# EAGLE design Blinky (EAGLE 8.6.0)
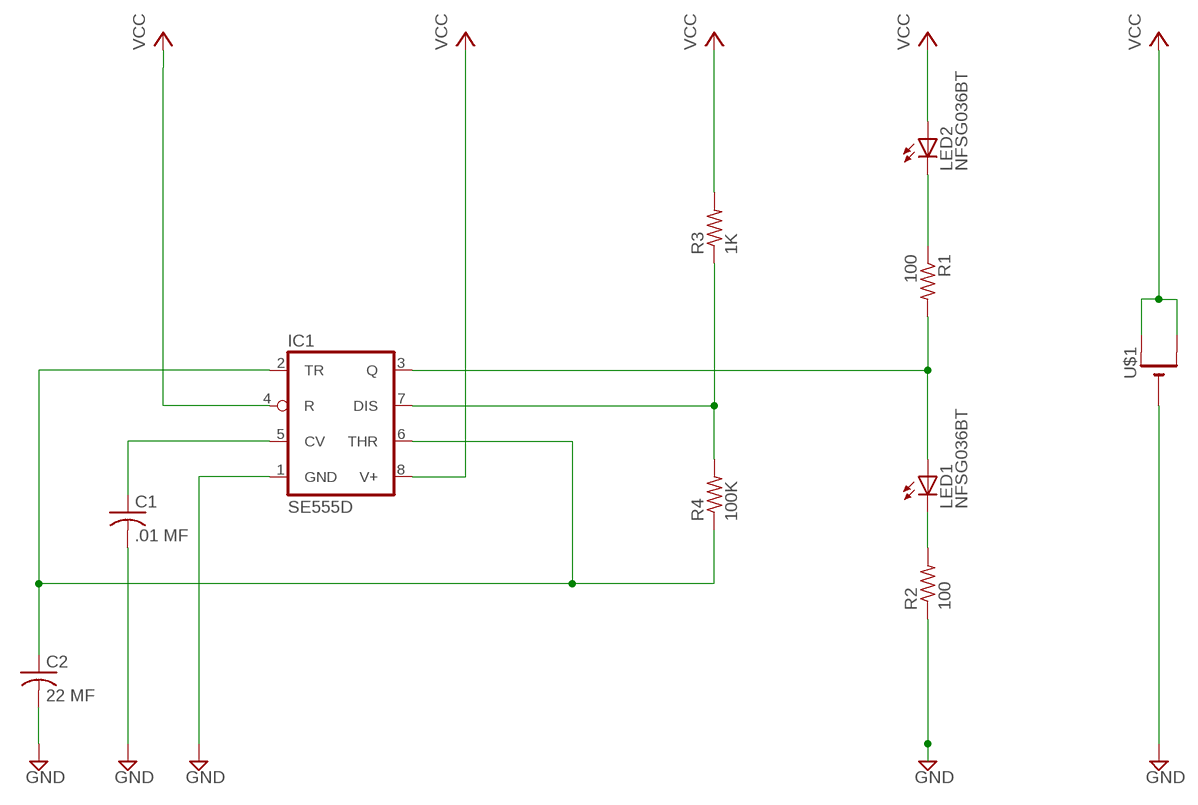
[diagram p0: schematic, sheet 1]

## Parts
C1  .01 MF  C-USC0805  [C0805]
C2  22 MF  C-USC0805  [C0805]
IC1  SE555D  [SO08]
LED1  NFSG036BT  [NFSG036BT]
LED2  NFSG036BT  [NFSG036BT]
R1  100  R-US_M0805  [M0805]
R2  100  R-US_M0805  [M0805]
R3  1K  R-US_M0805  [M0805]
R4  100K  R-US_M0805  [M0805]
U$1  CR1220THM  [CR1220-THM]

## Nets
GND: C1.2 C2.2 IC1.1(GND) R2.1 U$1.-
N$1: C1.1 IC1.5(CV)
N$2: IC1.7(DIS) R3.1 R4.2
N$3: IC1.3(Q) LED1.A R1.2
N$4: LED1.C R2.2
N$5: LED2.C R1.1
N$8: C2.1 IC1.2(TR) IC1.6(THR) R4.1
VCC: IC1.4(R) IC1.8(V+) LED2.A R3.2 U$1.+1(+) U$1.+2(+1)

## Library data of the parts
C1 = adafruit:C-US: CAPACITOR, American symbol; MPN: 885012007009; OC_NEWARK: 15AC9307
C2 = adafruit:C-US: CAPACITOR, American symbol; MPN: GRT21BR60J226ME13L; OC_NEWARK: 01AC8978
IC1 = linear:*555: TIMER; MF: FARNELL; MPN: TLC555CDR; OC_NEWARK: 38K8364
LED1 LED2 = led:NFSG036BT: CHIP TYPE GREEN LED NFSx036xT Source: NICHIA CORPORATION .. NFSG036BT-E.pdf; MPN: KPTD-2012ZGCK; OC_NEWARK: 16AC3387
R1 R2 = resistor:R-US_: RESISTOR, American symbol; MPN: MCTF0805BTC1000; OC_NEWARK: 01P2077
R3 = resistor:R-US_: RESISTOR, American symbol; MF: VISHAY/DALE; MPN: CRCW08051K00FKTA; OC_NEWARK: 05F1507
R4 = resistor:R-US_: RESISTOR, American symbol; MPN: CRCW0805100KFKTA; OC_NEWARK: 11AC2857
U$1 = adafruit:CR1220: CR1216/CR1220/CR1225 12mm 3V lithium coin cell Great for battery packup. Both SMT and THM holders. Note the THM package has the ground pads on both sides of the PCB so that the masks are the same - this reduces the cost; MF: KEYSTONE ELECTR; MPN: 500; OC_NEWARK: 95F3284

## Board
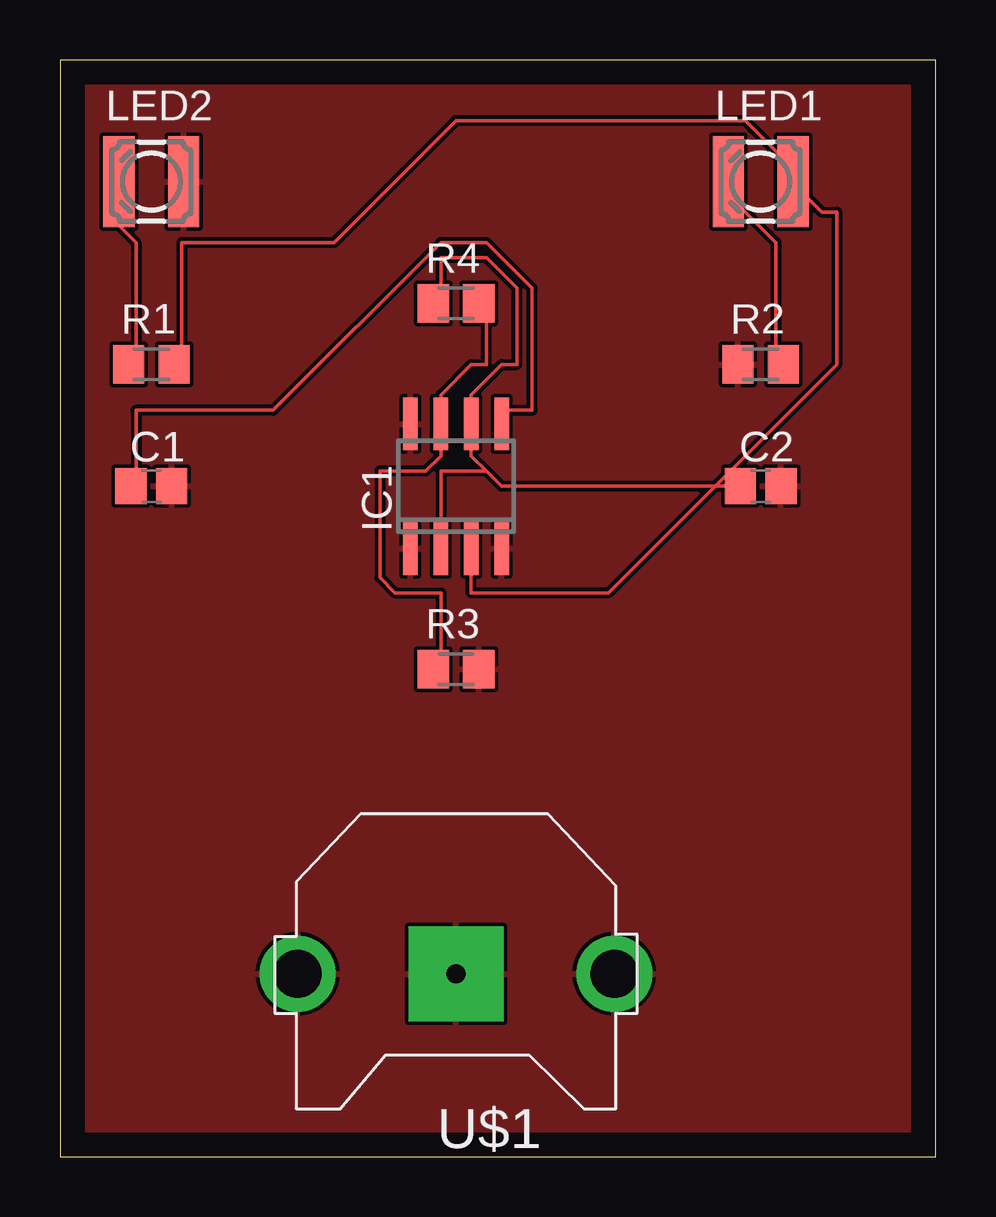
[diagram p1: board, top side]
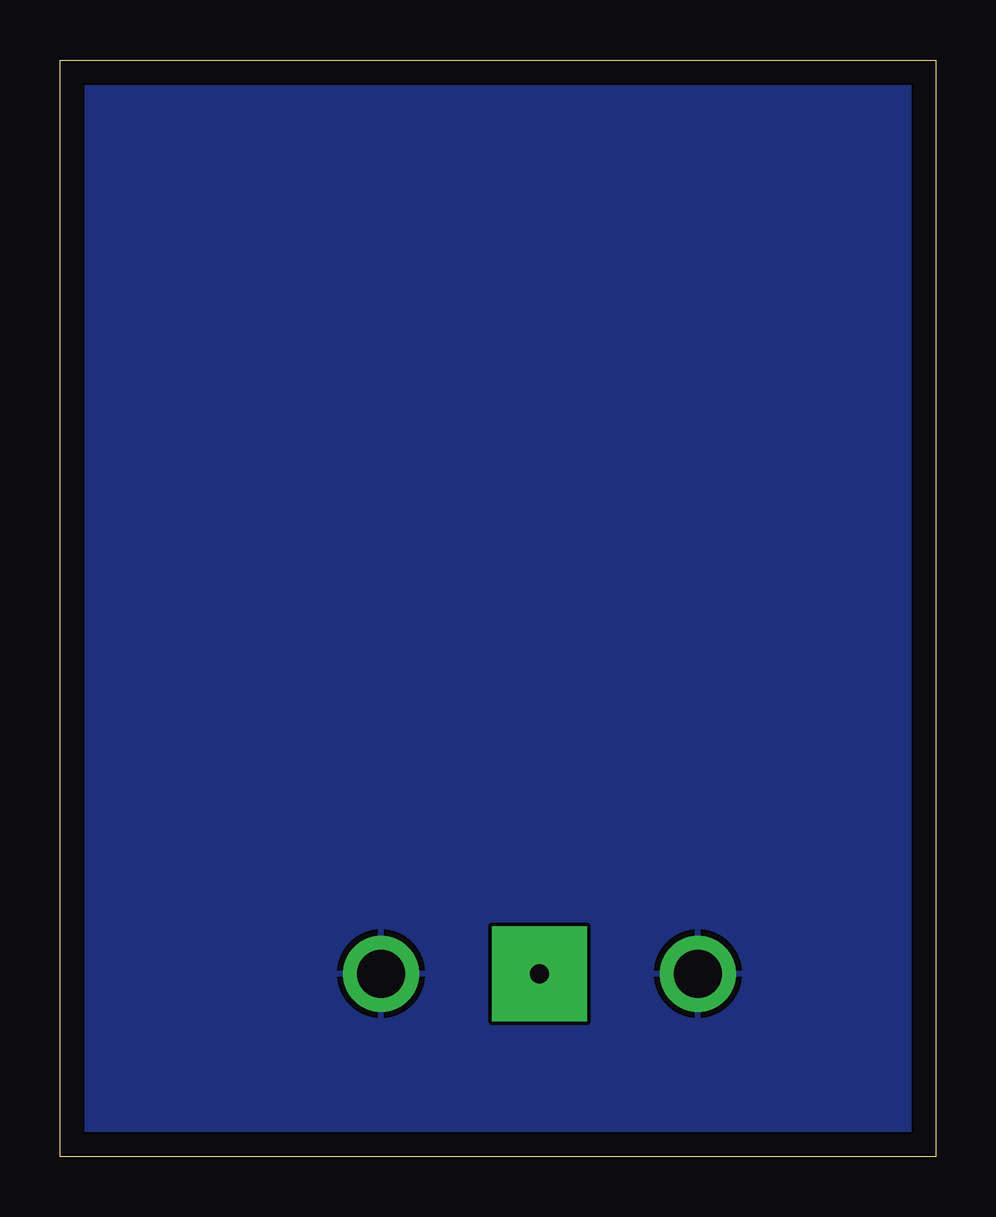
[diagram p2: board, bottom side, seen from below]

Size 36.5 x 45.71 mm. Coordinates in mm from the lower left corner, seen from the top.
Outline: 0,0 36.5,0 36.5,45.71 0,45.71 0,0
Copper layers (1*16): Top 0.035mm / dielectric 1.5mm / Bottom 0.035mm
Design rules "default": minimum track width 6mil, minimum drill 0.35mm, track to track 6mil, track to pad 6mil, pad to pad 6mil, via to via 6mil, smd to smd 6mil, copper to edge 40mil, drill to drill 6mil, minimum pad ring 10mil, minimum via ring 8mil, stop-mask expansion 4mil, vias tented up to drill 0mil, thermal gap 10mil

### Footprints (pad centres in the part's own frame; a part is rotated, then mirrored left to right if it is on the bottom)
C0805 = smd 1.3 x 1.5: 1 -0.85,0; 2 0.85,0
SO08 = smd 0.6 x 2.2: 1 -1.905,-2.6; 2 -0.635,-2.6; 3 0.635,-2.6; 4 1.905,-2.6; 5 1.905,2.6; 6 0.635,2.6; 7 -0.635,2.6; 8 -1.905,2.6
NFSG036BT = smd 1.3 x 3.8: A 1.35,0; C -1.35,0
M0805 = smd 1.3 x 1.6: 1 -0.95,0; 2 0.95,0
CR1220-THM = drill 2 pad 3.175: +1 -6.604,0; +2 6.604,0 | drill 0.8 pad 3.962 square: - 0,0

### Placement (x,y rotation side)
C1  3.81,27.94 0 top
C2  29.21,27.94 0 top
IC1  16.51,27.94 0 top
LED1  29.21,40.64 0 top
LED2  3.81,40.64 0 top
R1  3.81,33.02 0 top
R2  29.21,33.02 0 top
R3  16.51,20.32 0 top
R4  16.51,35.56 0 top
U$1  16.51,7.62 180 top

### Tracks (layer width: path | path; a pad name or v marks a point on that pad's centre or on a via)
GND
  pour Top: -1.27,45.72 -1.27,-1.27 38.1,-1.27 38.1,46.99 -1.27,46.99
N$1
  Top 0.152: C1.1 3.17,27.94 3.17,31.11 8.89,31.11 15.88,38.1 17.78,38.1 19.68,36.2 19.68,31.11 18.41,31.11 IC1.5
N$2
  Top 0.152: R3.1 15.88,20.32 15.88,23.5 13.97,23.5 13.34,24.13 13.34,28.57 15.24,28.57 15.88,29.21 IC1.7 15.88,31.75 17.14,33.02 17.78,33.02 17.78,35.56 R4.2
N$3
  Top 0.152: R1.2 5.08,33.02 5.08,38.1 11.43,38.1 16.51,43.18 28.57,43.18 31.11,40.64 LED1.A 30.48,40.64 31.75,39.37 32.38,39.37 32.38,33.02 22.86,23.5 17.14,23.5 IC1.3
N$4
  Top 0.152: R2.2 29.84,33.02 29.84,38.1 27.3,40.64 LED1.C
N$5
  Top 0.152: R1.1 3.17,33.02 3.17,38.1 2.54,38.73 2.54,40.64 LED2.C
N$8
  Top 0.152: C2.1 18.41,27.94 17.78,28.57 | 17.78,28.57 17.14,29.21 IC1.6 17.14,31.75 18.41,33.02 19.05,33.02 19.05,36.2 17.78,37.47 15.88,37.47 15.88,35.56 R4.1 | IC1.2 15.88,28.57 17.78,28.57
VCC
  pour Top: -1.27,45.72 -1.27,-1.27 38.1,-1.27 38.1,46.99 -1.27,46.99
  pour Bottom: -1.27,46.99 -1.27,-2.54 38.1,-2.54 38.1,46.99